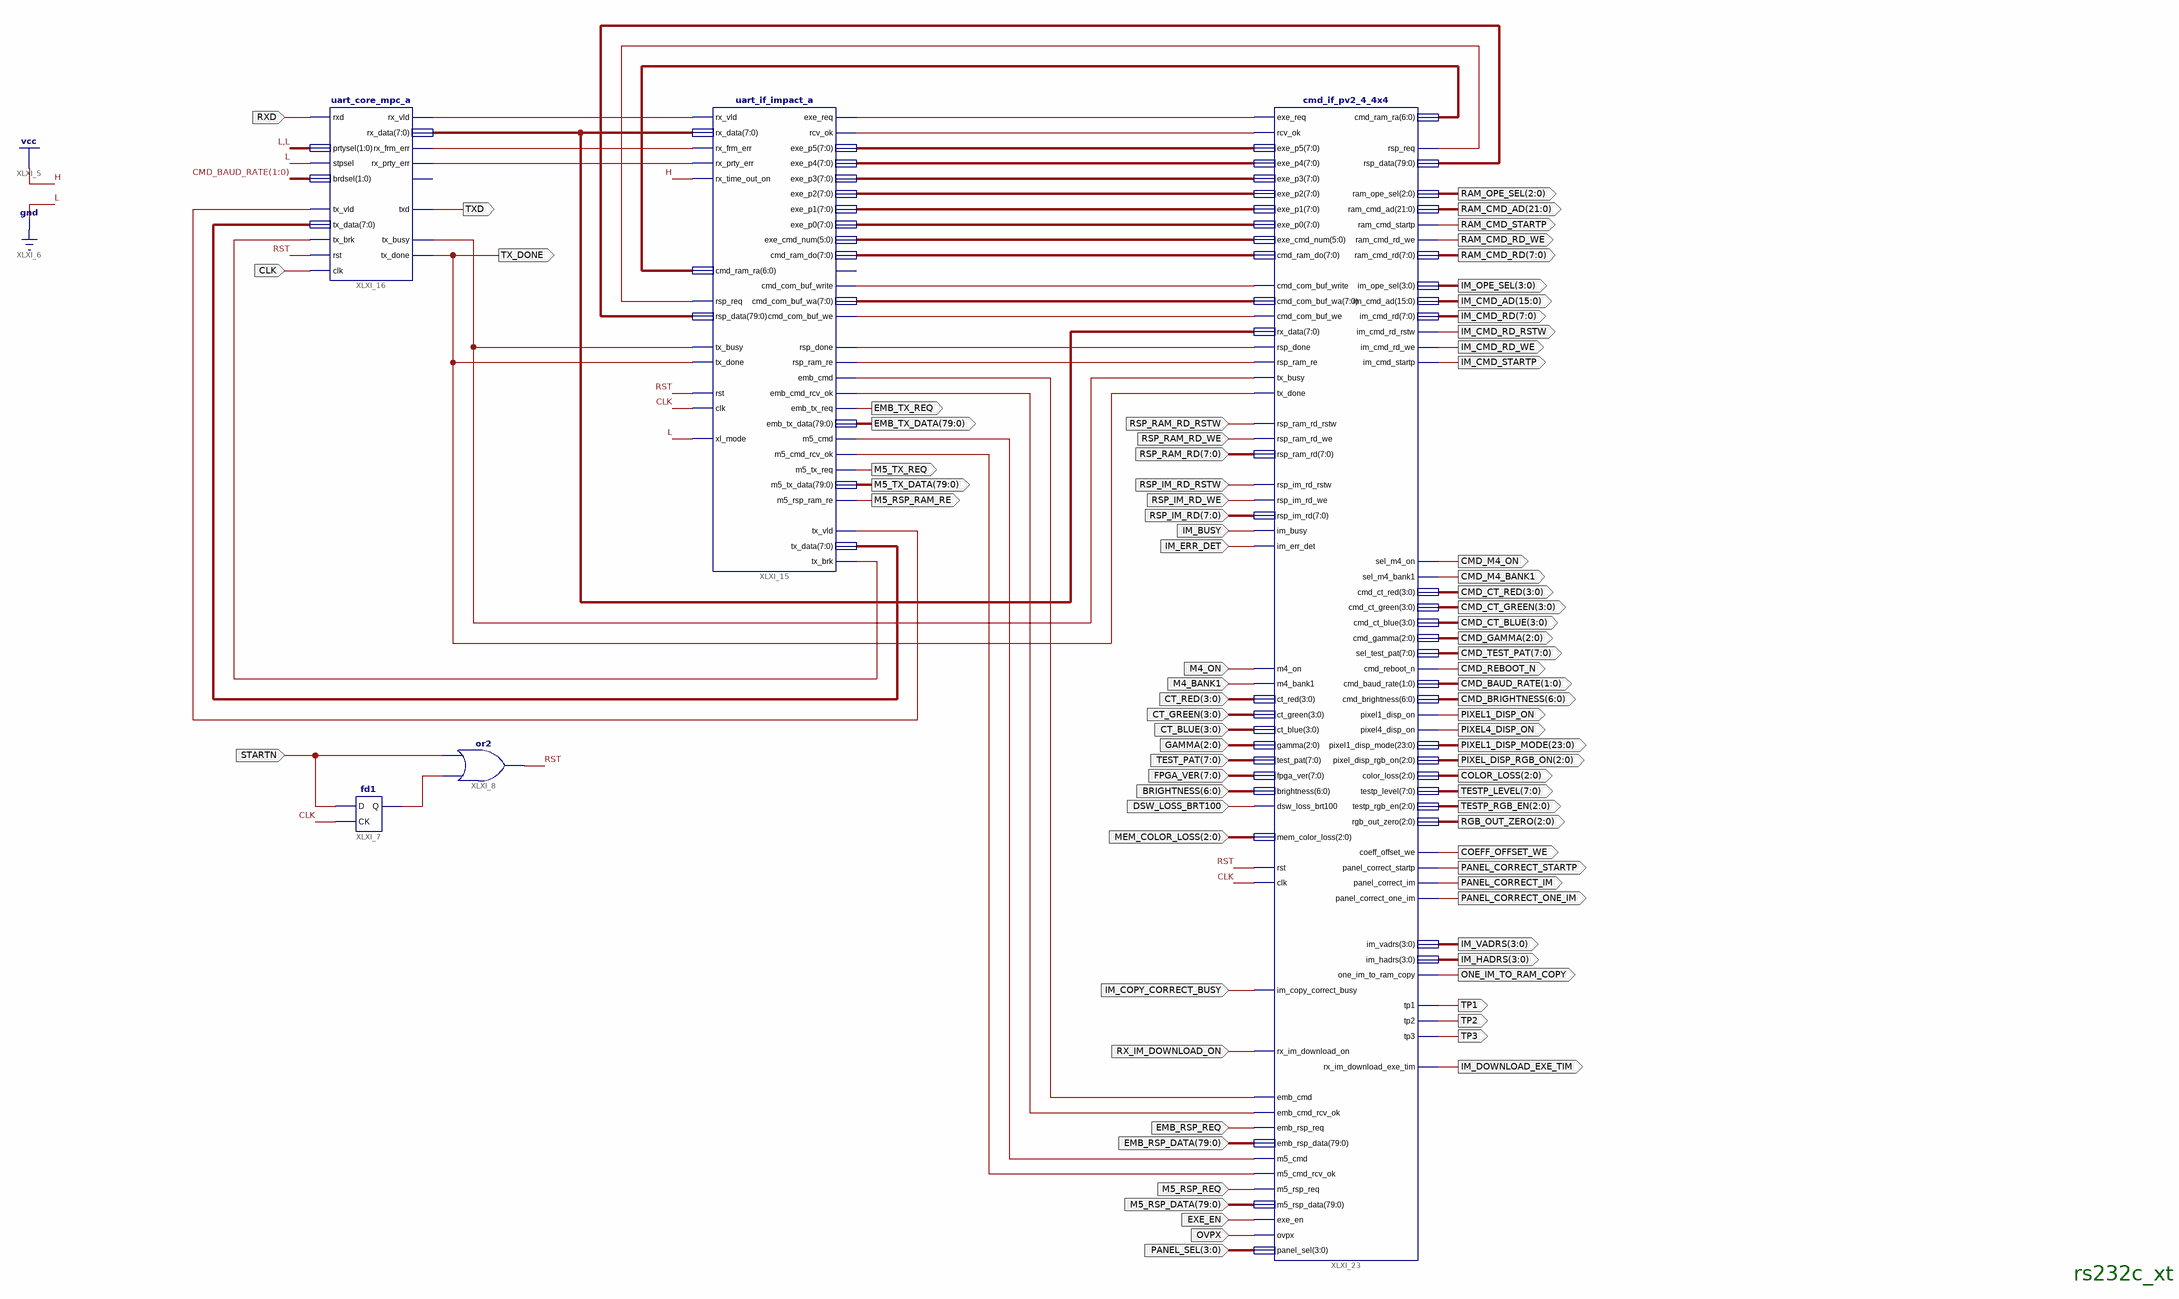
[diagram p0: schematic sheet 1]
// Xilinx ISE schematic rs232c_xt.sch (spartan6) as structural Verilog: 5 symbols, 78 ports
module rs232c_xt (
  input  RXD,
  input  CLK,
  input  RSP_RAM_RD_RSTW,
  input  RSP_RAM_RD_WE,
  input  [7:0] RSP_RAM_RD,
  input  RSP_IM_RD_RSTW,
  input  RSP_IM_RD_WE,
  input  [7:0] RSP_IM_RD,
  input  IM_BUSY,
  input  IM_ERR_DET,
  input  M4_ON,
  input  M4_BANK1,
  input  [3:0] CT_RED,
  input  [3:0] CT_GREEN,
  input  [3:0] CT_BLUE,
  input  [2:0] GAMMA,
  input  [7:0] TEST_PAT,
  input  [7:0] FPGA_VER,
  input  [6:0] BRIGHTNESS,
  input  DSW_LOSS_BRT100,
  input  [2:0] MEM_COLOR_LOSS,
  input  STARTN,
  input  IM_COPY_CORRECT_BUSY,
  input  RX_IM_DOWNLOAD_ON,
  input  EMB_RSP_REQ,
  input  [79:0] EMB_RSP_DATA,
  input  M5_RSP_REQ,
  input  [79:0] M5_RSP_DATA,
  input  EXE_EN,
  input  OVPX,
  input  [3:0] PANEL_SEL,
  output [1:0] CMD_BAUD_RATE,
  output [2:0] RAM_OPE_SEL,
  output [21:0] RAM_CMD_AD,
  output RAM_CMD_STARTP,
  output RAM_CMD_RD_WE,
  output [7:0] RAM_CMD_RD,
  output [3:0] IM_OPE_SEL,
  output [15:0] IM_CMD_AD,
  output [7:0] IM_CMD_RD,
  output IM_CMD_RD_RSTW,
  output IM_CMD_RD_WE,
  output IM_CMD_STARTP,
  output CMD_M4_ON,
  output CMD_M4_BANK1,
  output [3:0] CMD_CT_RED,
  output [3:0] CMD_CT_GREEN,
  output [3:0] CMD_CT_BLUE,
  output [2:0] CMD_GAMMA,
  output [7:0] CMD_TEST_PAT,
  output CMD_REBOOT_N,
  output [6:0] CMD_BRIGHTNESS,
  output PIXEL1_DISP_ON,
  output PIXEL4_DISP_ON,
  output [23:0] PIXEL1_DISP_MODE,
  output [2:0] PIXEL_DISP_RGB_ON,
  output TX_DONE,
  output [2:0] COLOR_LOSS,
  output [7:0] TESTP_LEVEL,
  output [2:0] TESTP_RGB_EN,
  output [2:0] RGB_OUT_ZERO,
  output COEFF_OFFSET_WE,
  output PANEL_CORRECT_STARTP,
  output PANEL_CORRECT_IM,
  output TP1,
  output TP2,
  output TP3,
  output ONE_IM_TO_RAM_COPY,
  output IM_DOWNLOAD_EXE_TIM,
  output [79:0] EMB_TX_DATA,
  output EMB_TX_REQ,
  output M5_TX_REQ,
  output [79:0] M5_TX_DATA,
  output M5_RSP_RAM_RE,
  output TXD,
  output PANEL_CORRECT_ONE_IM,
  output [3:0] IM_VADRS,
  output [3:0] IM_HADRS
);

  wire RST, XLXN_18, XLXN_80, XLXN_82, XLXN_83, XLXN_84, XLXN_85, XLXN_94, XLXN_95, XLXN_96, XLXN_98,
       XLXN_99, XLXN_132, XLXN_134, XLXN_138, XLXN_141, XLXN_143, XLXN_163, XLXN_165;
  wire [5:0] XLXN_92;
  wire [6:0] XLXN_14;
  wire [7:0] XLXN_12, XLXN_81, XLXN_86, XLXN_87, XLXN_88, XLXN_89, XLXN_90, XLXN_91, XLXN_93, XLXN_133;
  wire [79:0] XLXN_148;

  fd1 XLXI_7 (.D(STARTN), .CK(CLK), .Q(XLXN_138));
  or XLXI_8 (RST, XLXN_138, STARTN);
  uart_if_impact_a XLXI_15 (
    .clk(CLK), .rst(RST), .rx_vld(XLXN_80), .rx_frm_err(XLXN_82), .rx_prty_err(XLXN_83),
    .rx_time_out_on(1'b1), .xl_mode(1'b0), .tx_busy(XLXN_99), .tx_done(TX_DONE), .rsp_req(XLXN_18),
    .rx_data(XLXN_81), .cmd_ram_ra(XLXN_14), .rsp_data(XLXN_148), .exe_req(XLXN_84), .rcv_ok(XLXN_85),
    .emb_cmd(XLXN_141), .emb_cmd_rcv_ok(XLXN_143), .m5_cmd(XLXN_163), .m5_cmd_rcv_ok(XLXN_165),
    .emb_tx_req(EMB_TX_REQ), .m5_tx_req(M5_TX_REQ), .cmd_com_buf_write(XLXN_132), .cmd_com_buf_we(XLXN_134),
    .tx_vld(XLXN_98), .tx_brk(XLXN_96), .rsp_done(XLXN_94), .rsp_ram_re(XLXN_95),
    .m5_rsp_ram_re(M5_RSP_RAM_RE), .exe_p5(XLXN_86), .exe_p4(XLXN_87), .exe_p3(XLXN_88), .exe_p2(XLXN_89),
    .exe_p1(XLXN_90), .exe_p0(XLXN_91), .exe_cmd_num(XLXN_92), .emb_tx_data(EMB_TX_DATA),
    .m5_tx_data(M5_TX_DATA), .cmd_ram_do(XLXN_93), .cmd_com_buf_wa(XLXN_133), .tx_data(XLXN_12));  // open: rx_time_out
  uart_core_mpc_a XLXI_16 (
    .clk(CLK), .rst(RST), .rxd(RXD), .tx_vld(XLXN_98), .tx_brk(XLXN_96), .stpsel(1'b0), .tx_data(XLXN_12),
    .prtysel(2'b00), .brdsel(CMD_BAUD_RATE), .txd(TXD), .tx_busy(XLXN_99), .tx_done(TX_DONE),
    .rx_vld(XLXN_80), .rx_frm_err(XLXN_82), .rx_prty_err(XLXN_83), .rx_data(XLXN_81));  // open: rx_brk
  cmd_if_pv2_4_4x4 XLXI_23 (
    .clk(CLK), .rst(RST), .exe_req(XLXN_84), .rcv_ok(XLXN_85), .rsp_ram_rd_rstw(RSP_RAM_RD_RSTW),
    .rsp_ram_rd_we(RSP_RAM_RD_WE), .rsp_im_rd_rstw(RSP_IM_RD_RSTW), .rsp_im_rd_we(RSP_IM_RD_WE),
    .rsp_ram_re(XLXN_95), .tx_done(TX_DONE), .im_err_det(IM_ERR_DET), .m4_on(M4_ON), .m4_bank1(M4_BANK1),
    .im_busy(IM_BUSY), .im_copy_correct_busy(IM_COPY_CORRECT_BUSY), .rsp_done(XLXN_94), .tx_busy(XLXN_99),
    .dsw_loss_brt100(DSW_LOSS_BRT100), .cmd_com_buf_write(XLXN_132), .cmd_com_buf_we(XLXN_134),
    .rx_im_download_on(RX_IM_DOWNLOAD_ON), .emb_cmd(XLXN_141), .emb_cmd_rcv_ok(XLXN_143),
    .emb_rsp_req(EMB_RSP_REQ), .m5_cmd(XLXN_163), .m5_cmd_rcv_ok(XLXN_165), .m5_rsp_req(M5_RSP_REQ),
    .exe_en(EXE_EN), .ovpx(OVPX), .panel_sel(PANEL_SEL), .exe_p5(XLXN_86), .exe_p4(XLXN_87),
    .exe_p3(XLXN_88), .exe_p2(XLXN_89), .exe_p1(XLXN_90), .exe_p0(XLXN_91), .exe_cmd_num(XLXN_92),
    .cmd_ram_do(XLXN_93), .rsp_ram_rd(RSP_RAM_RD), .rsp_im_rd(RSP_IM_RD), .ct_red(CT_RED),
    .ct_green(CT_GREEN), .ct_blue(CT_BLUE), .gamma(GAMMA), .test_pat(TEST_PAT), .fpga_ver(FPGA_VER),
    .brightness(BRIGHTNESS), .mem_color_loss(MEM_COLOR_LOSS), .cmd_com_buf_wa(XLXN_133), .rx_data(XLXN_81),
    .emb_rsp_data(EMB_RSP_DATA), .m5_rsp_data(M5_RSP_DATA), .ram_cmd_rd_we(RAM_CMD_RD_WE),
    .coeff_offset_we(COEFF_OFFSET_WE), .im_cmd_rd_rstw(IM_CMD_RD_RSTW), .im_cmd_rd_we(IM_CMD_RD_WE),
    .ram_cmd_startp(RAM_CMD_STARTP), .panel_correct_startp(PANEL_CORRECT_STARTP),
    .one_im_to_ram_copy(ONE_IM_TO_RAM_COPY), .im_cmd_startp(IM_CMD_STARTP), .rsp_req(XLXN_18),
    .cmd_reboot_n(CMD_REBOOT_N), .pixel1_disp_on(PIXEL1_DISP_ON), .pixel4_disp_on(PIXEL4_DISP_ON),
    .sel_m4_on(CMD_M4_ON), .sel_m4_bank1(CMD_M4_BANK1), .panel_correct_im(PANEL_CORRECT_IM),
    .panel_correct_one_im(PANEL_CORRECT_ONE_IM), .rx_im_download_exe_tim(IM_DOWNLOAD_EXE_TIM), .tp1(TP1),
    .tp2(TP2), .tp3(TP3), .im_ope_sel(IM_OPE_SEL), .ram_ope_sel(RAM_OPE_SEL), .im_cmd_ad(IM_CMD_AD),
    .ram_cmd_ad(RAM_CMD_AD), .cmd_ram_ra(XLXN_14), .ram_cmd_rd(RAM_CMD_RD), .im_cmd_rd(IM_CMD_RD),
    .im_vadrs(IM_VADRS), .im_hadrs(IM_HADRS), .rsp_data(XLXN_148), .cmd_ct_red(CMD_CT_RED),
    .cmd_ct_green(CMD_CT_GREEN), .cmd_ct_blue(CMD_CT_BLUE), .cmd_gamma(CMD_GAMMA),
    .cmd_baud_rate(CMD_BAUD_RATE), .cmd_brightness(CMD_BRIGHTNESS), .pixel1_disp_mode(PIXEL1_DISP_MODE),
    .pixel_disp_rgb_on(PIXEL_DISP_RGB_ON), .color_loss(COLOR_LOSS), .testp_level(TESTP_LEVEL),
    .rgb_out_zero(RGB_OUT_ZERO), .sel_test_pat(CMD_TEST_PAT), .testp_rgb_en(TESTP_RGB_EN));

  // Notes on the sheet:
  //   rs232c_xt
endmodule
